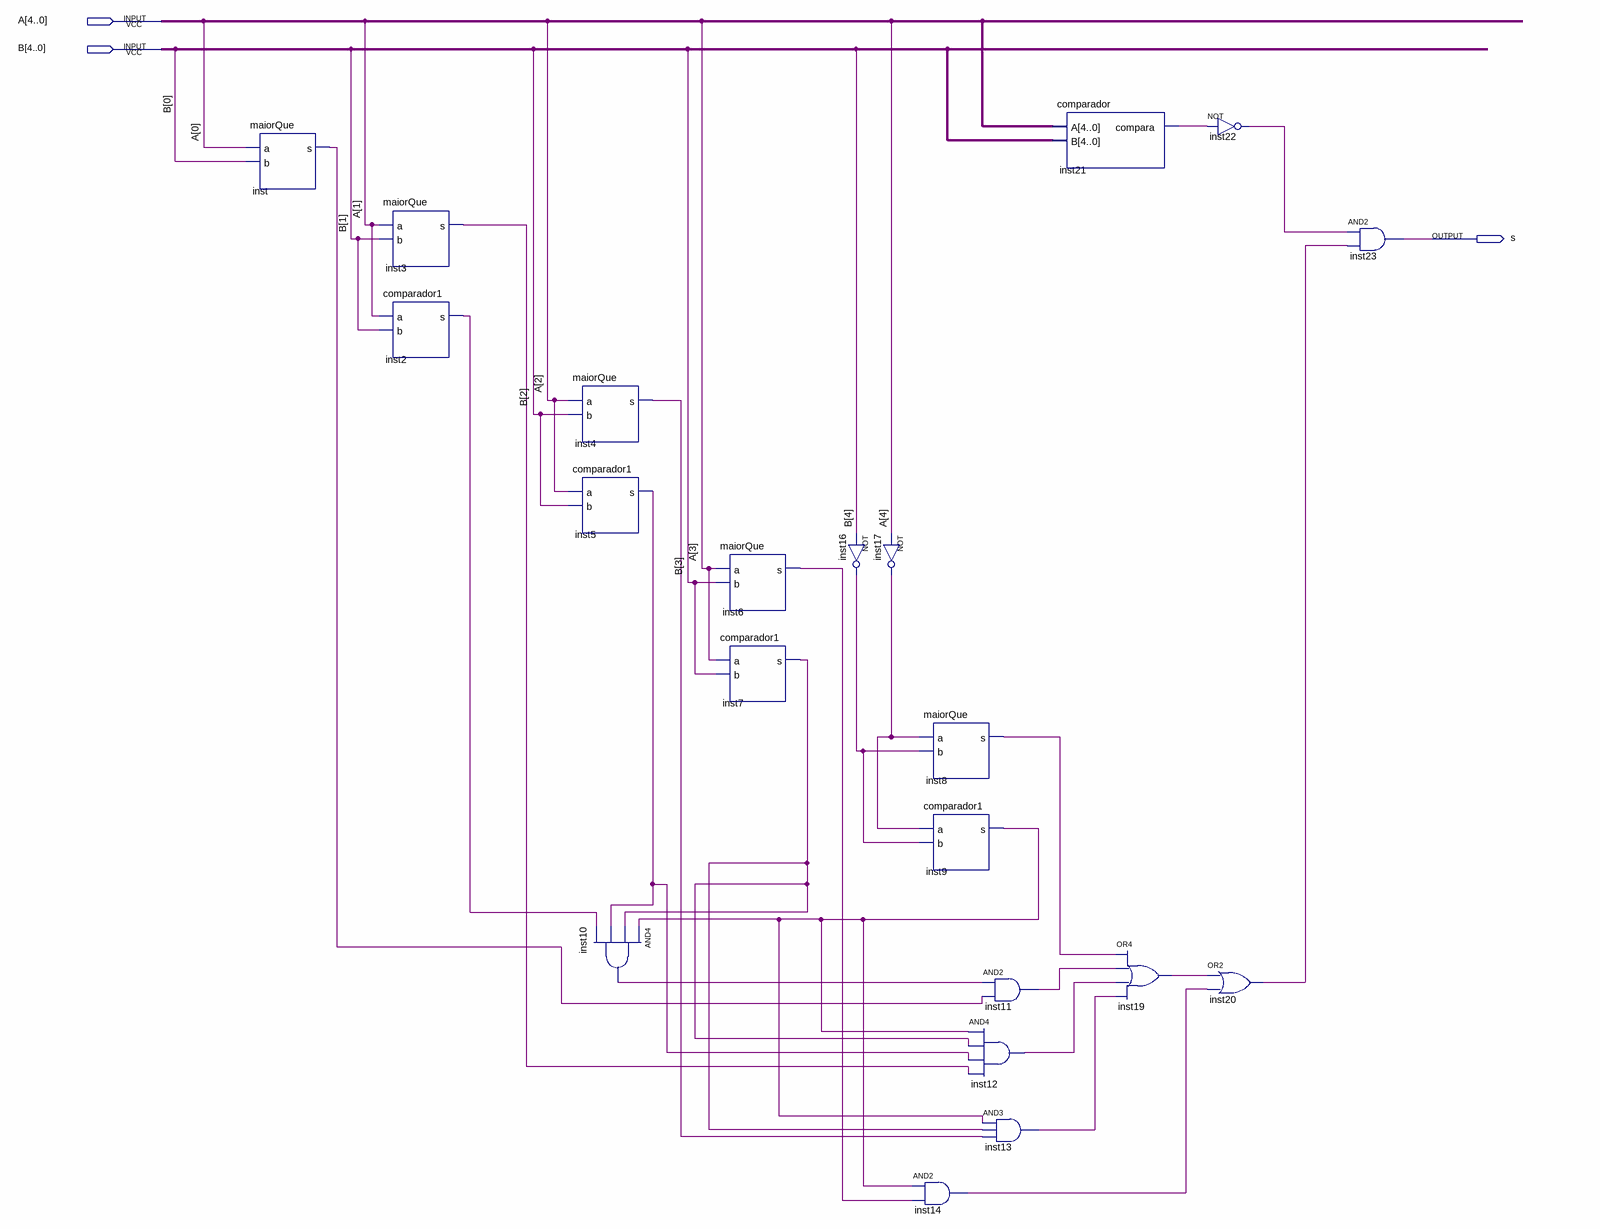
[diagram p0: schematic sheet]
// Quartus schematic maiorQue.bdf as structural Verilog: 21 symbols, 3 pins
module maiorQue (
  input  [4:0] A,
  input  [4:0] B,
  output s
);

  wire inst2_s, inst3_s, inst4_s, inst5_s, inst6_s, inst7_s, inst8_s, inst9_s, inst10_out, inst11_out,
       inst12_out, inst13_out, inst14_out, inst16_out, inst17_out, inst19_out, inst20_out, inst21_compara,
       inst22_out, inst_s;

  maiorQue inst (.a(A[0]), .b(B[0]), .s(inst_s));
  maiorQue inst3 (.a(A[1]), .b(B[1]), .s(inst3_s));
  comparador1 inst2 (.a(A[1]), .b(B[1]), .s(inst2_s));
  maiorQue inst4 (.a(A[2]), .b(B[2]), .s(inst4_s));
  comparador1 inst5 (.a(A[2]), .b(B[2]), .s(inst5_s));
  and inst10 (inst10_out, inst9_s, inst7_s, inst5_s, inst2_s);
  maiorQue inst6 (.a(A[3]), .b(B[3]), .s(inst6_s));
  comparador1 inst7 (.a(A[3]), .b(B[3]), .s(inst7_s));
  not inst16 (inst16_out, B[4]);
  not inst17 (inst17_out, A[4]);
  maiorQue inst8 (.a(inst17_out), .b(inst16_out), .s(inst8_s));
  comparador1 inst9 (.a(inst17_out), .b(inst16_out), .s(inst9_s));
  and inst14 (inst14_out, inst9_s, inst6_s);
  and inst12 (inst12_out, inst9_s, inst7_s, inst5_s, inst3_s);
  and inst11 (inst11_out, inst10_out, inst_s);
  and inst13 (inst13_out, inst9_s, inst7_s, inst4_s);
  comparador inst21 (.A(A), .B(B), .compara(inst21_compara));
  or inst19 (inst19_out, inst8_s, inst11_out, inst12_out, inst13_out);
  not inst22 (inst22_out, inst21_compara);
  or inst20 (inst20_out, inst19_out, inst14_out);
  and inst23 (s, inst22_out, inst20_out);
endmodule
